# EasyEDA Pro project EasyEDApro.epro, board Main board
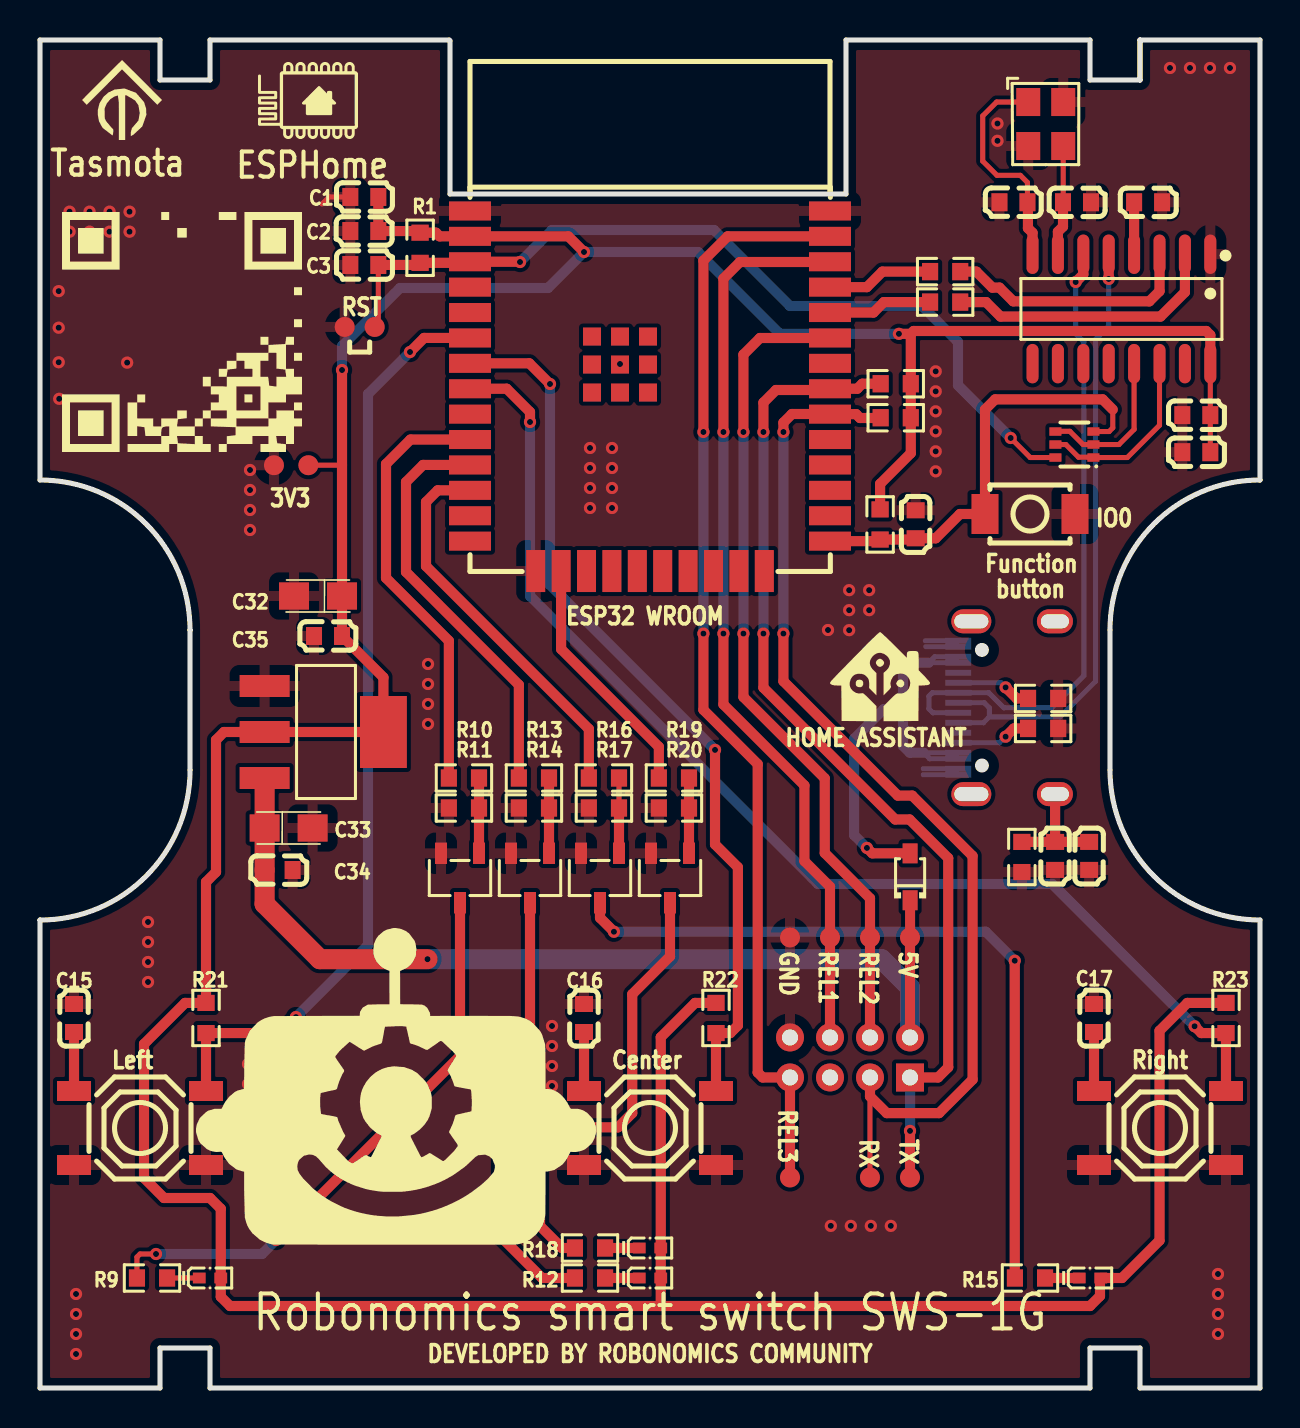
[diagram p4: board, top side]
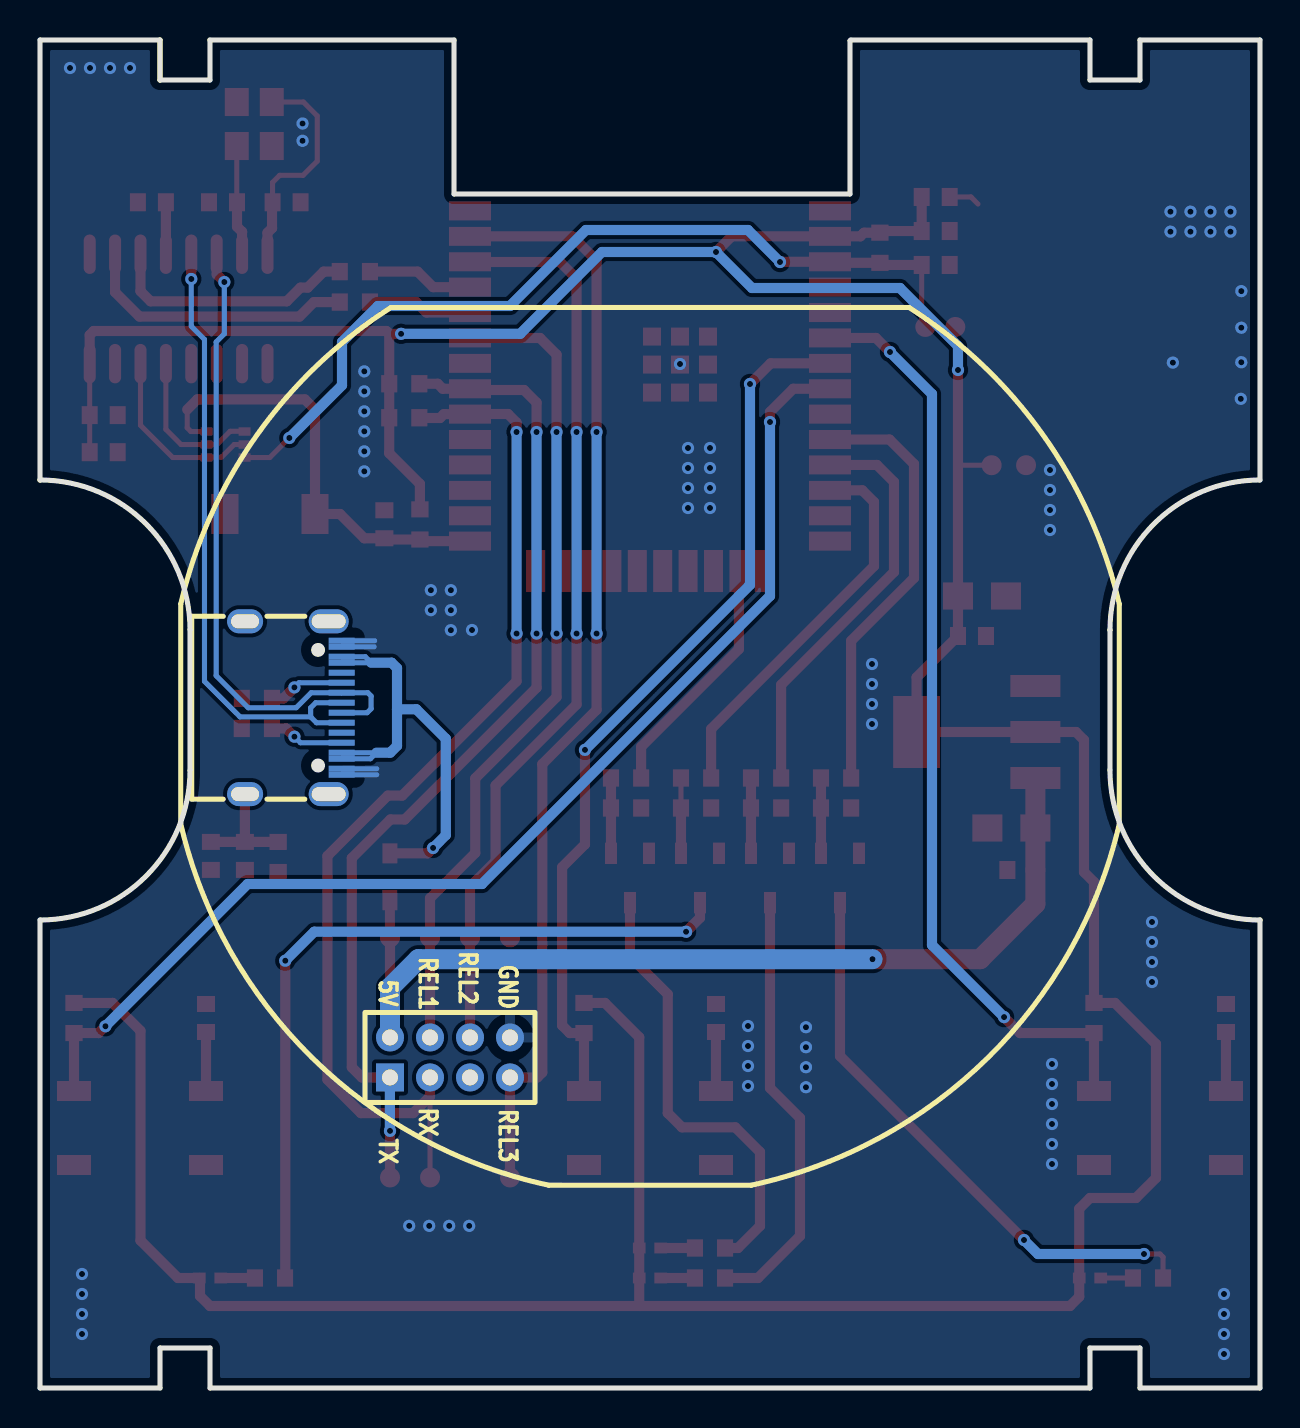
[diagram p5: board, bottom side, seen from below]

Outline 61 x 67.4 mm; copper layers: Top Layer, Bottom Layer. Coordinates in mm from the lower left corner of the outline.
Outline path: rectangle 55,67.4 55,65.4 ; 0,67.4 6,67.4 6,65.4 8.5,65.4 8.5,67.4 20.46,67.4 20.5,67.36 20.5,59.7 40.3,59.7 40.3,67.4 52.5,67.4 52.5,65.4 55,65.4 55,67.4 61,67.4 61,45.4 61,45.4 arc(55.7,43.2) 53.5,37.9 53.5,30.9 arc(55.7,25.6) 61,23.4 61,0 55,0 55,2 52.5,2 52.5,0 8.5,0 8.5,2 6,2 6,0 0,0 0,23.4 0,23.4 arc(5.31,25.59) 7.5,30.9 7.5,37.9 7.5,37.9 arc(5.31,43.2) 0,45.4 0,67.4
Stack: Top Layer 0.035mm / Dielectric1 1.51mm FR4 er 4.5 / Bottom Layer 0.035mm

## Design rules (mm)
spacing safeClearance (default): track to track 0.152, other pairs 0.152 to 0.3
track width trackWidth (default): min 0.127, default 0.254, max 2.54
differential pair differentialPair (default): width min 0.127, default 0.254, max 2.54; gap min 0.152, default 0.152
via viaSize (default): diameter min 0.5, default 0.61, max 10; hole min 0.3, default 0.305, max 6

## Placement (name value [footprint] x y rotation side)
C1  100nF  [C0603]  16.22 59.55 180 top
C2  10uF  [C0603]  16.22 57.85 0 top
C3  100nF  [C0603]  16.22 56.15 180 top
C4  100nF  [C0603]  55.41 59.29 180 top
C5  100nF  [C0603]  57.82 48.64 180 top
C6  10nF  [C0603]  57.82 46.79 180 top
C7  22pF  [C0603]  51.85 59.29 180 top
C8  22pF  [C0603]  48.67 59.29 0 top
C9  100nF  [C0603]  52.46 26.6 90 top
C10  1nF  [C0603]  50.76 26.6 90 top
C15  100nF  [C0603]  1.7 18.5 90 top
C16  100nF  [C0603]  27.2 18.5 90 top
C17  100nF  [C0603]  52.7 18.5 90 top
C18  100nF  [C0603]  43.78 43.19 90 top
C32  22uF  [CASE-A_3216]  13.9 39.6 180 top
C33  22uF  [CASE-A_3216]  12.43 28 0 top
C34  100nF  [C0603]  11.93 25.9 180 top
C35  100nF  [C0603]  14.4 37.6 0 top
D1  -  [SOD-323_L1.8-W1.3-LS2.5-RD]  43.51 25.56 90 top
LED1  -  [LED0402-RD_BLUE]  8.5 5.5 0 top
LED2  -  [LED0402-RD_BLUE]  30.5 5.5 0 top
LED3  -  [LED0402-RD_BLUE]  52.5 5.5 0 top
LED4  -  [LED0402-RD_GREEN]  30.5 7 0 top
NOREF  -  [Pad_e1971]  39.5 22.53 270 top
NOREF#2  -  [Pad_e1238]  11.7 46.14 180 top
NOREF#3  -  [Pad_e1200]  15.24 53.05 0 top
NOREF#4  -  [Pad_e1201]  16.74 53.05 0 top
NOREF#5  -  [Pad_e1973]  41.5 22.53 270 top
NOREF#6  -  [Pad_e1237]  13.42 46.14 180 top
NOREF#7  -  [Pad_e903]  41.5 10.53 270 top
NOREF#8  -  [Pad_e1069]  37.5 22.53 270 top
NOREF#9  -  [Pad_e1979]  37.5 10.53 270 top
NOREF#10  -  [Pad_e5115]  43.5 22.53 0 top
NOREF#11  -  [Pad_e901]  43.5 10.53 270 top
Q1  -  [SC-70-6_L2.2-W1.3-P0.65-LS2.1-BR]  51.72 47.17 0 top
Q2  -  [SOT-23-3_L2.9-W1.6-P1.90-LS2.8-BR]  21 25.5 90 top
Q3  -  [SOT-23-3_L2.9-W1.6-P1.90-LS2.8-BR]  24.5 25.5 90 top
Q4  -  [SOT-23-3_L2.9-W1.6-P1.90-LS2.8-BR]  28 25.5 90 top
Q5  -  [SOT-23-3_L2.9-W1.6-P1.90-LS2.8-BR]  31.5 25.5 90 top
R1  10kΩ  [R0603]  19.01 57.01 270 top
R2  4.7kΩ  [R0603]  42.79 50.21 180 top
R3  4.7kΩ  [R0603]  42.79 48.51 180 top
R4  470  [R0603]  45.26 54.3 0 top
R5  470  [R0603]  45.26 55.82 0 top
R6  5.1kΩ  [R0603]  50.16 32.98 180 top
R7  5.1kΩ  [R0603]  50.16 34.48 180 top
R8  1MΩ  [R0603]  49.09 26.55 90 top
R9  10kΩ  [R0603]  5.6 5.5 0 top
R10  1kΩ  [R0603]  21.2 30.5 0 top
R11  10kΩ  [R0603]  21.2 29 180 top
R12  10kΩ  [R0603]  27.5 5.5 0 top
R13  1kΩ  [R0603]  24.7 30.5 0 top
R14  10kΩ  [R0603]  24.7 29 180 top
R15  10kΩ  [R0603]  49.5 5.5 0 top
R16  1kΩ  [R0603]  28.2 30.5 0 top
R17  10kΩ  [R0603]  28.2 29 180 top
R18  10kΩ  [R0603]  27.5 7 0 top
R19  1kΩ  [R0603]  31.7 30.5 0 top
R20  10kΩ  [R0603]  31.7 29 180 top
R21  10kΩ  [R0603]  8.3 18.5 270 top
R22  10kΩ  [R0603]  33.8 18.5 270 top
R23  10kΩ  [R0603]  59.3 18.5 270 top
R24  10kΩ  [R0603]  42.01 43.18 270 top
SW1  TS-1187A-C-J-B  [SW-SMD_4P-L5.1-W5.1-P3.70-LS6.5-TL-2]  5 13 0 top
SW2  TS-1187A-C-J-B  [SW-SMD_4P-L5.1-W5.1-P3.70-LS6.5-TL-2]  30.5 13 0 top
SW3  TS-1187A-C-J-B  [SW-SMD_4P-L5.1-W5.1-P3.70-LS6.5-TL-2]  56 13 0 top
SW4  -  [SW-SMD_L3.9-W2.9-P4.15-LS5.0]  49.5 43.7 180 top
U2  -  [WIFI-SMD_ESP32-WROOM-32E]  30.5 49.85 270 top
U3  -  [CONN-TH_8P-P2.00_DEALON_DW200R-22-08-45]  40.5 16.53 180 bottom
U4  -  [SOIC-16_L9.9-W3.9-P1.27-LS6.0-BL]  54.07 53.95 180 top
U11  AMS1117-3.3  [SOT-223-3_L6.5-W3.4-P2.30-LS7.0-BR]  14.2 32.8 180 top
USB1  -  [USB-C-SMD_KH-TYPE-C-16P]  48.33 34.01 270 bottom
X1  12MHz  [OSC-SMD_4P-L3.2-W2.5-BL]  50.29 63.2 270 top

## Footprints (pads in the part's own frame, mm; a bottom-side part is the same pattern mirrored in y, then rotated)
C0603
  rect 0.8x0.9 smd: 1(-0.7,0) 2(0.7,0)
CASE-A_3216
  rect 1.5x1.359 smd: 1(-1.2,0) 2(1.2,0)
CONN-TH_8P-P2.00_DEALON_DW200R-22-08-45
  rect 1.4x1.4 hole 0.8: 1(-3,-1)
  round 1.4 hole 0.8: 2(-3,1) 3(-1,-1) 4(-1,1) 5(1,-1) 6(1,1) 7(3,-1) 8(3,1)
LED0402-RD_BLUE
  rect 0.636x0.54 smd: 1(-0.538,0) 2(0.538,0)
LED0402-RD_GREEN
  rect 0.636x0.54 smd: 1(-0.538,0) 2(0.538,0)
OSC-SMD_4P-L3.2-W2.5-BL
  rect 1.4x1.2 smd: 1(-1.1,-0.875) 2(1.1,-0.875) 3(1.1,0.875) 4(-1.1,0.875)
Pad_e901
  round 1 smd: TP1(0,0)
Pad_e903
  round 1 smd: TP3(0,0)
Pad_e1069
  round 1 smd: TP8(0,0)
Pad_e1200
  round 1 smd: TP2(0,0)
Pad_e1201
  round 1 smd: TP3(0,0)
Pad_e1237
  round 1 smd: TP12(0,0)
Pad_e1238
  round 1 smd: TP13(0,0)
Pad_e1971
  round 1 smd: TP8(0,0)
Pad_e1973
  round 1 smd: TP8(0,0)
Pad_e1979
  round 1 smd: w(0,0)
Pad_e5115
  round 1 smd: TP5(0,0)
R0603
  rect 0.806x0.864 smd: 1(-0.753,0) 2(0.753,0)
SC-70-6_L2.2-W1.3-P0.65-LS2.1-BR
  rect 0.6x0.42 smd: 1(0.95,-0.65) 2(0.95,0) 3(0.95,0.65) 4(-0.95,0.65) 5(-0.95,0) 6(-0.95,-0.65)
SOD-323_L1.8-W1.3-LS2.5-RD
  rect 1x0.75 smd: 1(-1.173,0) 2(1.173,0)
SOIC-16_L9.9-W3.9-P1.27-LS6.0-BL
  oval 0.602x1.971 smd: 1(-4.445,-2.736) 2(-3.175,-2.736) 3(-1.905,-2.736) 4(-0.635,-2.736) 5(0.635,-2.736) 6(1.905,-2.736) 7(3.175,-2.736) 8(4.445,-2.736) 9(4.445,2.736) 10(3.175,2.736) 11(1.905,2.736) 12(0.635,2.736) 13(-0.635,2.736) 14(-1.905,2.736) 15(-3.175,2.736) 16(-4.445,2.736)
SOT-23-3_L2.9-W1.6-P1.90-LS2.8-BR
  rect 1.07x0.6 smd: 1(1.235,-0.95) 2(1.235,0.95) 3(-1.235,0)
SOT-223-3_L6.5-W3.4-P2.30-LS7.0-BR
  rect 2.5x1.1 smd: 1(2.97,-2.3) 2(2.97,0) 3(2.97,2.3)
  rect 2.34x3.6 smd: 4(-2.97,0)
SW-SMD_4P-L5.1-W5.1-P3.70-LS6.5-TL-2
  rect 1.7x1 smd: 1(-3.3,1.85) 2(3.3,1.85) 3(-3.3,-1.85) 4(3.3,-1.85)
SW-SMD_L3.9-W2.9-P4.15-LS5.0
  rect 1.35x2 smd: 1(-2.25,0) 2(2.25,0)
USB-C-SMD_KH-TYPE-C-16P
  oval 1.2x2 hole 0.7x1.7: 1(-4.32,1.765) 2(4.32,1.765)
  oval 1.2x1.8 hole 0.7x1.4: 3(-4.32,-2.415) 4(4.32,-2.415)
  rect 0.3x1.3 smd: A1(-3.35,2.415) A4(-2.55,2.415) A5(-1.25,2.415) A6(-0.25,2.415) A7(0.25,2.415) A8(1.25,2.415) A9(2.55,2.415) A12(3.35,2.415) B1(3.05,2.415) B4(2.25,2.415) B5(1.75,2.415) B6(0.75,2.415) B7(-0.75,2.415) B8(-1.75,2.415) B9(-2.25,2.415) B12(-3.05,2.415)
WIFI-SMD_ESP32-WROOM-32E
  rect 0.95x2.1 smd: 1(-9.002,-9) 2(-7.732,-9) 3(-6.463,-9) 4(-5.192,-9) 5(-3.922,-9) 6(-2.652,-9) 7(-1.383,-9) 8(-0.113,-9) 9(1.157,-9) 10(2.428,-9) 11(3.697,-9) 12(4.968,-9) 13(6.237,-9) 14(7.508,-9) 25(7.508,9) 26(6.237,9) 27(4.968,9) 28(3.697,9) 29(2.428,9) 30(1.157,9) 31(-0.113,9) 32(-1.383,9) 33(-2.652,9) 34(-3.922,9) 35(-5.192,9) 36(-6.463,9) 37(-7.732,9) 38(-9.002,9)
  rect 2.1x0.95 smd: 15(9.002,-5.715) 16(9.002,-4.445) 17(9.002,-3.175) 18(9.002,-1.905) 19(9.002,-0.635) 20(9.002,0.635) 21(9.002,1.905) 22(9.002,3.175) 23(9.002,4.445) 24(9.002,5.715)
  rect 0.9x0.9 smd: 39(-2.721,-0.1) 39(-2.721,-1.5) 39(-2.721,-2.9) 39(-1.321,-0.1) 39(-1.321,-1.5) 39(-1.321,-2.9) 39(0.079,-0.1) 39(0.079,-1.5) 39(0.079,-2.9)

## Nets
As in the schematic, except:
+5V: C33.1 C34.2 D1.1 NOREF#10.TP5 U3.2 U11.3
GND: C1.2 C2.1 C3.2 C4.1 C5.2 C6.2 C7.1 C8.1 C9.1 C10.1 C15.2 C16.2 C17.2 C18.2 C32.2 C33.2 C34.1 C35.1 NOREF#2.TP13 NOREF#3.TP2 NOREF#8.TP8 Q2.2 Q3.2 Q4.2 Q5.2 R6.1 R7.1 R8.1 R11.2 R14.2 R17.2 R20.2 SW1.3 SW1.4 SW2.3 SW2.4 SW3.3 SW3.4 SW4.1 U2.1 U2.15 U2.38 U2.39 U3.8 U4.1 U11.1 USB1.A1 USB1.A12 USB1.B1 USB1.B12 X1.2 X1.4
VDD_ESP32: C1.1 C2.2 C5.1 C6.1 C32.1 C35.2 LED1.2 LED2.2 LED3.2 LED4.2 NOREF#6.TP12 R1.1 R2.1 R3.1 R21.1 R22.1 R23.1 R24.1 U2.2 U4.16 U11.2 U11.4
ESP_EN: C3.1 NOREF#4.TP3 Q1.6 R1.2 U2.3
GPIO_RELAY1: NOREF.TP8 U2.36 U3.6
GPIO_RELAY2: NOREF#5.TP8 U2.33 U3.4
GPIO_RELAY3: NOREF#9.w U2.37 U3.7
PM_RX: NOREF#7.TP3 R3.2 U2.30 U3.3
PM_TX: NOREF#11.TP1 R2.2 U2.31 U3.1

Pads without a net: U2 4 5 9 13 14 17 18 19 20 21 22 23 24 26 27 28 29 32; U3 5; U4 9 10 11 12 15; USB1 A8 B8

## Via types
v1: diameter 0.61, hole 0.305, Top Layer to Bottom Layer, 110 vias

## Routing (per net, layer and track width the routed paths; a pad name or vN(x,y) marks a point on that pad's centre or on a via; arc(x,y) is an arc through that point)
+5V: length 49.7
  Top Layer w0.5: NOREF#10.TP5 43.51,22.53 D1.1
  Top Layer w0.508: NOREF#10.TP5 U3.2
  Top Layer w1: v1(19.38,21.44) 13.99,21.44 11.23,24.2 C34.2 C33.1 U11.3
  Bottom Layer w1: v1(19.38,21.44) 42.08,21.44 43.5,20.02 U3.2
GND: length 8.3
  Top Layer w0.254: 14.1,59.2 14.45,59.55 C1.2
  Bottom Layer w0.254: USB1.A12 44.17,30.66 ; USB1.B12 44.29,37.06 ; USB1.A1 44.27,37.36 ; USB1.B1 44.17,30.96
  vias: v1(0.94,54.84) v1(0.94,53.02) v1(0.94,51.29) v1(0.96,49.46) v1(1.48,58.82) v1(1.48,57.82) v1(1.8,4.7) v1(1.8,3.7) v1(1.8,2.7) v1(1.8,1.7) v1(2.48,58.82) v1(2.48,57.82) v1(3.48,58.82) v1(3.48,57.82) v1(4.36,51.27) v1(4.48,58.82) v1(4.48,57.82) v1(5.4,23.3) v1(5.4,22.3) v1(5.4,21.3) v1(5.4,20.3) v1(10.4,16.2) v1(10.4,15.2) v1(10.4,14.2) v1(10.4,13.2) v1(10.4,12.2) v1(10.4,11.2) v1(10.5,45.9) v1(10.5,44.9) v1(10.5,43.9) v1(10.5,42.9) v1(19.4,36.2) v1(19.4,35.2) v1(19.4,34.2) v1(19.4,33.2) v1(22.7,18.04) v1(22.7,17.04) v1(22.7,16.04) v1(22.7,15.04) v1(25.6,18.1) v1(25.6,17.1) v1(25.6,16.1) v1(25.6,15.1) v1(27.5,47) v1(27.5,46) v1(27.5,45) v1(27.5,44) v1(28.6,47) v1(28.6,46) v1(28.6,45) v1(28.6,44) v1(29,51.2) v1(39.4,37.9) v1(39.54,8.11) v1(40.46,39.89) v1(40.46,38.89) v1(40.46,37.89) v1(40.54,8.11) v1(41.46,39.89) v1(41.46,38.89) v1(41.54,8.11) v1(42.54,8.11) v1(44.79,50.83) v1(44.79,49.83) v1(44.79,48.83) v1(44.79,47.83) v1(44.79,46.83) v1(44.79,45.83) v1(47.88,63.22) v1(47.88,62.36) v1(56.5,66) v1(57.5,66) v1(58.5,66) v1(58.9,5.7) v1(58.9,4.7) v1(58.9,3.7) v1(58.9,2.7) v1(59.5,66)
VDD_ESP32: length 218.2
  Top Layer w0.254: 58.52,51.22 C5.1 C6.1 ; NOREF#6.TP12 15.09,46.14 15.1,46.15
  Top Layer w0.508: C1.1 C2.2 18.92,57.85 R1.1 19.8,57.76 19.98,57.58 21.26,57.58 ; U2.2 26.42,57.58 v1(27.2,56.8) ; v1(42.95,52.71) 43.54,52.71 ; 43.54,52.71 R2.1 R3.1 43.54,46.74 42.01,45.2 R24.1 ; 43.54,52.71 43.68,52.85 58.31,52.85 58.52,52.65 58.52,51.22 ; 31.01,4.1 52.5,4.1 53,4.6 53,5.46 LED3.2 54.1,5.5 55.98,7.38 55.98,17.86 57.37,19.25 R23.1 ; 31.01,4.1 31.04,4.13 LED2.2 LED4.2 31.04,17.54 32.75,19.25 R22.1 ; 31.01,4.1 9.5,4.1 9.04,4.56 LED1.2 9.04,8.96 8.5,9.5 6.2,9.5 5.2,10.5 5.2,17.2 7.25,19.25 R21.1 8.3,25.3 8.8,25.8 8.8,32.4 9.2,32.8 U11.2 U11.4 17.17,35.53 C35.2 C32.1 v1(15.1,50.9)
  Bottom Layer w0.508: v1(42.95,52.71) 36.99,52.71 32.9,56.8 v1(27.2,56.8) 25.4,55 18,55 15.1,52.1 v1(15.1,50.9)
BUTTON: length 22.1
  Top Layer w0.254: Q1.3 53.46,47.82 53.64,48.01 53.64,48.92
  Top Layer w0.508: 41.8,42.34 U2.25 ; R24.2 43.72,42.42 C18.1 44.79,42.49 46,43.7 SW4.2 47.25,48.92 47.76,49.43 53.13,49.43 53.64,48.92
CC1: length 3.8
  Top Layer w0.508: R6.2 48.69,32.98 v1(48.28,32.57)
  Bottom Layer w0.254: USB1.B5 47.98,32.26 v1(48.28,32.57)
CC2: length 3.8
  Top Layer w0.508: R7.2 48.83,34.48 v1(48.28,35.03)
  Bottom Layer w0.254: v1(48.28,35.03) 48.05,35.26 USB1.A5
CENTER_BUTTON: length 44.5
  Top Layer w0.508: U2.7 24.47,51.23 v1(25.5,50.2) ; SW2.2 R22.2 34.51,17.75 34.9,18.13 34.9,26.04 33.75,27.18 v1(33.75,31.91)
  Bottom Layer w0.508: v1(25.5,50.2) 25.5,40.16 v1(33.75,31.91)
DTR: length 7.8
  Top Layer w0.254: 54.71,51.22 54.71,47.93 53.95,47.17 Q1.2 52.15,47.17 51.49,47.83 50.78,47.83 Q1.4
ESP_EN: length 43.5
  Top Layer w0.254: C3.1 16.92,53.23 NOREF#4.TP3 ; Q1.6 49.51,46.52 v1(48.54,47.5)
  Top Layer w0.508: C3.1 18.9,56.15 R1.2 21.2,56.26 21.26,56.31 ; U2.3 23.99,56.31 v1(24,56.3)
  Bottom Layer w0.508: v1(24,56.3) 25.6,57.9 33.7,57.9 37.5,54.1 44.1,54.1 45.9,52.3 45.9,50.14 v1(48.54,47.5)
ESP_RX0: length 5.4
  Top Layer w0.508: U2.34 41.67,53.77 42.2,54.3 R4.1 44.38,54.42
ESP_TX0: length 5.3
  Top Layer w0.508: R5.1 42.12,55.82 41.34,55.04 U2.35
GPIO_LED_RELAY1: length 21.7
  Top Layer w0.508: U2.10 18.52,47.42 17.3,46.2 17.3,40.5 20.44,37.36 20.44,30.5
GPIO_LED_RELAY2: length 20.7
  Top Layer w0.508: 23.94,30.5 23.94,35.16 18.3,40.8 18.3,45.3 19.15,46.15 U2.11
GPIO_LED_RELAY3: length 19.6
  Top Layer w0.508: 27.44,30.5 27.44,32.95 19.3,41.09 19.3,44.3 19.88,44.88 U2.12
GPIO_LED_SATUS: length 12.4
  Top Layer w0.508: U2.16 26.06,36.94 30.94,32.06 30.94,30.5
GPIO_RELAY1: length 45.8
  Top Layer w0.508: U2.36 39.49,56.3 35,56.3 34.17,55.47 v1(34.17,47.8) ; U3.6 NOREF.TP8 39.5,25.06 38.22,26.34 38.22,30.13 34.17,34.18 v1(34.17,37.72)
  Bottom Layer w0.508: v1(34.17,37.72) v1(34.17,47.8)
GPIO_RELAY2: length 41.4
  Top Layer w0.508: U3.4 NOREF#5.TP8 41.5,24.49 39.24,26.75 39.24,30.48 35.17,34.55 v1(35.17,37.72) ; U2.33 39.5,52.5 36,52.5 35.17,51.67 v1(35.17,47.8)
  Bottom Layer w0.508: v1(35.17,37.72) v1(35.17,47.8)
GPIO_RELAY3: length 55.3
  Top Layer w0.508: NOREF#9.w U3.7 36.14,15.53 35.89,15.78 35.89,31.19 33.17,33.91 v1(33.17,37.72) ; v1(33.17,47.8) 33.17,56.37 34.38,57.58 U2.37
  Bottom Layer w0.508: v1(33.17,37.72) v1(33.17,47.8)
LEFT_BUTTON: length 46.6
  Top Layer w0.508: U2.6 19.2,52.5 v1(18.5,51.8) ; v1(12.8,18.55) 12,17.75 R21.2 SW1.2
  Bottom Layer w0.508: v1(12.8,18.55) 16.4,22.15 16.4,49.7 v1(18.5,51.8)
PM_RX: length 54.4
  Top Layer w0.254: NOREF#7.TP3 41.5,15.53
  Top Layer w0.508: U3.3 41.5,14.58 42.34,13.74 44.95,13.74 46.63,15.42 46.63,26.6 43.61,29.62 42.89,29.62 37.17,35.34 v1(37.17,37.72) ; v1(37.17,47.8) 37.17,48.27 37.6,48.7 39.49,48.7 U2.30 40.81,48.69 41,48.5 42.02,48.5 R3.2
  Bottom Layer w0.508: v1(37.17,37.72) v1(37.17,47.8)
PM_TX: length 50.8
  Top Layer w0.508: U3.1 44.9,15.53 45.41,16.03 45.41,26.5 43.48,28.43 42.76,28.43 36.17,35.02 v1(36.17,37.72) ; v1(36.17,47.8) 36.17,49.27 36.8,49.9 39.44,49.9 U2.31 40.86,49.96 41.11,50.21 R2.2 ; NOREF#11.TP1 43.5,12.83 43.53,12.86
  Bottom Layer w0.508: v1(36.17,37.72) v1(36.17,47.8) ; U3.1 43.51,15.52 43.51,12.88
  vias: v1(43.5,12.86)
RIGHT_BUTTON: length 59.4
  Top Layer w0.508: v1(57.73,18.09) 58.07,17.75 R23.2 SW3.2 ; U2.8 23.34,49.96 24.5,48.8 v1(24.5,48.3)
  Bottom Layer w0.508: v1(57.73,18.09) 50.62,25.2 38.9,25.2 24.5,39.6 v1(24.5,48.3)
RTS: length 9.2
  Top Layer w0.254: 55.98,51.22 55.98,48.14 54.37,46.52 Q1.1 52.66,46.54 51.93,46.54 51.29,47.17 Q1.5
SHIELD: length 5.8
  Top Layer w0.508: C10.2 C9.2 ; C10.2 50.76,29.68 USB1.4 ; C10.2 R8.2
USBDN: length 32.4
  Top Layer w0.508: v1(51.79,55.3) 52.17,55.68 U4.6
  Bottom Layer w0.254: v1(51.79,55.3) 51.79,52.71 52.19,52.3 52.19,35.61 50.59,34.01 48.19,34.01 47.44,34.76 USB1.B7 44.61,34.76 44.45,34.6 44.45,33.96 44.64,33.76 USB1.A7
USBDP: length 31.5
  Top Layer w0.508: v1(53.44,55.45) U4.5
  Bottom Layer w0.254: v1(53.44,55.45) 53.44,53.09 52.78,52.43 52.78,35.33 51,33.56 47.47,33.56 ; USB1.B6 47.18,33.26 47.47,33.56 ; 47.47,33.56 47.47,34.01 47.21,34.26 USB1.A6
VUSB: length 24.2
  Top Layer w0.508: D1.2 41.62,26.73 v1(41.35,27)
  Bottom Layer w0.254: USB1.B9 44.44,36.26 44.74,36.56 USB1.A4 ; USB1.B4 44.18,31.76 44.48,31.46 USB1.A9
  Bottom Layer w0.508: 43.15,33.94 43.15,32.11 43.5,31.76 44.18,31.76 ; 43.15,33.94 42.18,33.94 40.71,32.46 40.71,27.64 v1(41.35,27) ; 43.15,33.94 43.15,36 43.42,36.26 44.44,36.26
X0: length 11.2
  Top Layer w0.254: 49.4,59.26 C8.2 49.37,60.28 49.02,60.63 47.85,60.63 47.14,61.34 47.14,63.61 47.83,64.3 X1.1
  Top Layer w0.508: U4.8 49.63,57.76 49.4,57.99 49.4,59.26
X1: length 5.5
  Top Layer w0.254: X1.3 51.16,59.3 C7.2
  Top Layer w0.508: C7.2 51.15,58.07 50.9,57.81 U4.7
$1N1912: length 1.6
  Top Layer w0.254: LED1.1 R9.2
$1N1913: length 29
  Top Layer w0.254: R9.1 4.85,6.55 5,6.7 v1(5.8,6.7)
  Top Layer w0.508: v1(11.8,7.4) 21,16.6 Q2.3
  Bottom Layer w0.508: v1(5.8,6.7) 11.1,6.7 v1(11.8,7.4)
$1N1918: length 3.8
  Top Layer w0.508: Q2.1 R11.1 R10.2
$1N1919: length 1.7
  Top Layer w0.508: LED4.1 R18.2
$1N1920: length 22.6
  Top Layer w0.508: R18.1 26.1,7 25,8.1 25,11.8 26.23,13.03 28.9,13.03 29.61,13.74 29.61,19.69 31.5,21.58 Q5.3
$1N1924: length 3.8
  Top Layer w0.508: Q5.1 R20.1 R19.2
$1N10887: length 1.7
  Top Layer w0.508: LED2.1 R12.2
$1N10888: length 21.9
  Top Layer w0.508: R12.1 25.1,5.5 23,7.6 23,13.5 24.5,15 Q3.3
$1N10892: length 3.8
  Top Layer w0.508: R13.2 R14.1 Q3.1
$1N11267: length 1.7
  Top Layer w0.508: LED3.1 R15.2
$1N11268: length 38.3
  Top Layer w0.508: R15.1 48.74,5.51 v1(48.74,21.36) 48.75,21.36 ; v1(28.7,22.81) 28,23.51 Q4.3
  Bottom Layer w0.508: v1(48.74,21.36) 47.29,22.81 v1(28.7,22.81)
$1N11272: length 3.8
  Top Layer w0.254: R17.1 R16.2
  Top Layer w0.508: Q4.1 R17.1
$1N27173: length 2.6
  Top Layer w0.508: U4.4 C4.2
$1N27175: length 12.6
  Top Layer w0.508: U4.3 55.98,54.84 55.47,54.33 48.66,54.33 47.98,55.02 47.62,55.02 46.82,55.82 R5.2
$1N27176: length 13.9
  Top Layer w0.508: U4.2 57.25,54.79 56.03,53.57 48.03,53.57 47.3,54.3 R4.2
$1N42639: length 3
  Top Layer w0.508: C15.1 SW1.1
$1N42662: length 3
  Top Layer w0.508: SW3.1 C17.1
$1N42685: length 3
  Top Layer w0.508: C16.1 SW2.1

## Copper pours and planes (outline as drawn; the poured copper is in the pictures)
GND on Top Layer: -2.91,68.31 62.44,68.31 62.44,-3.31 -2.91,-3.31
GND on Bottom Layer: -4.1,68.95 63.7,68.95 63.7,-1.75 -4.1,-1.75

## Text on the board
Bottom Silkscreen Layer: REL3 | GND | REL2 | REL1 | RX | 5V | TX
Top Silkscreen Layer: Left | 3V3 | ESP32 WROOM | Center | Function | button | IO0 | Right | DEVELOPED BY ROBONOMICS COMMUNITY | HOME ASSISTANT | GND | REL1 | RX | REL2 | 5V | TX | RST | REL3 | Tasmota | ESPHome | Robonomics smart switch SWS-1G
